# EAGLE design power_breakout_board (EAGLE 7.1.0)
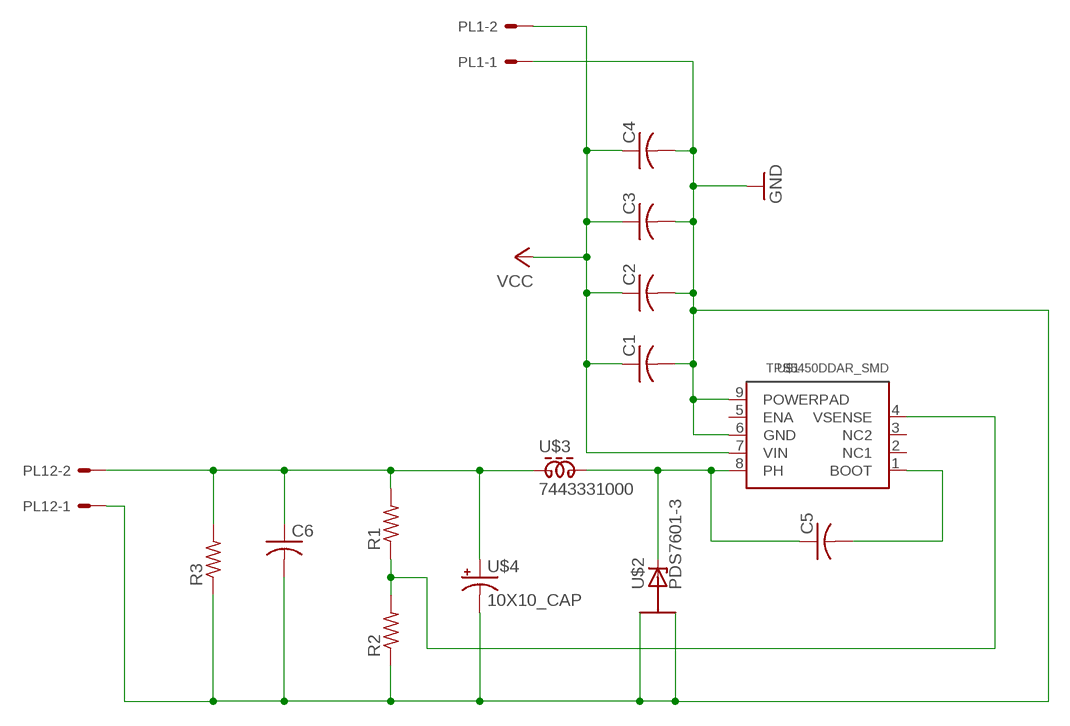
[diagram p0: schematic, sheet 1]

## Parts
C1  C-USC1206K  [C1206K]
C2  C-USC1206K  [C1206K]
C3  C-USC1206K  [C1206K]
C4  C-USC1206K  [C1206K]
C5  C-USC0805K  [C0805K]
C6  C-USC1206K  [C1206K]
PL1  555X-2H  [5569-2]
PL12  555X-2H  [5569-2]
R1  R-US_R1206  [R1206]
R2  R-US_R1206  [R1206]
R3  R-US_R1206  [R1206]
U$1  TPS5450DDAR_SMD  [SO-POWERPAD]
U$2  PDS7601-3  [POWERDI-5_SMD]
U$3  7443331000  [7443331000_SMD]
U$4  10X10_CAP  [10X10_CAP_SMD]

## Nets
GND: C1.2 C2.2 C3.2 C4.2 C6.2 PL1.1 PL12.1 R2.1 R3.1 U$1.6(GND) U$1.9(POWERPAD) U$2.LEFT U$2.RIGHT U$4.-
N$5: C5.2 U$1.1(BOOT)
N$9: R1.1 R2.2 U$1.4(VSENSE)
PH: C5.1 U$1.8(PH) U$2.HEAT U$3.P2
VCC: C1.1 C2.1 C3.1 C4.1 PL1.2 U$1.7(VIN)
VOUT: C6.1 PL12.2 R1.2 R3.2 U$3.P1 U$4.+
Unconnected: U$1.2(NC1) U$1.3(NC2) U$1.5(ENA)

## Library data of the parts
C1-C6 = rcl:C-US: CAPACITOR, American symbol
PL1 PL12 = con-molex-2:555X-2: Mini FIT connector 2 way
R1-R3 = rcl:R-US_: RESISTOR, American symbol
U$1 = TIparts:TPS5450DDAR_SMD
U$2 = TIparts:PDS7601-3
U$3 = TIparts:7443331000
U$4 = TIparts:10X10_CAP

## Board
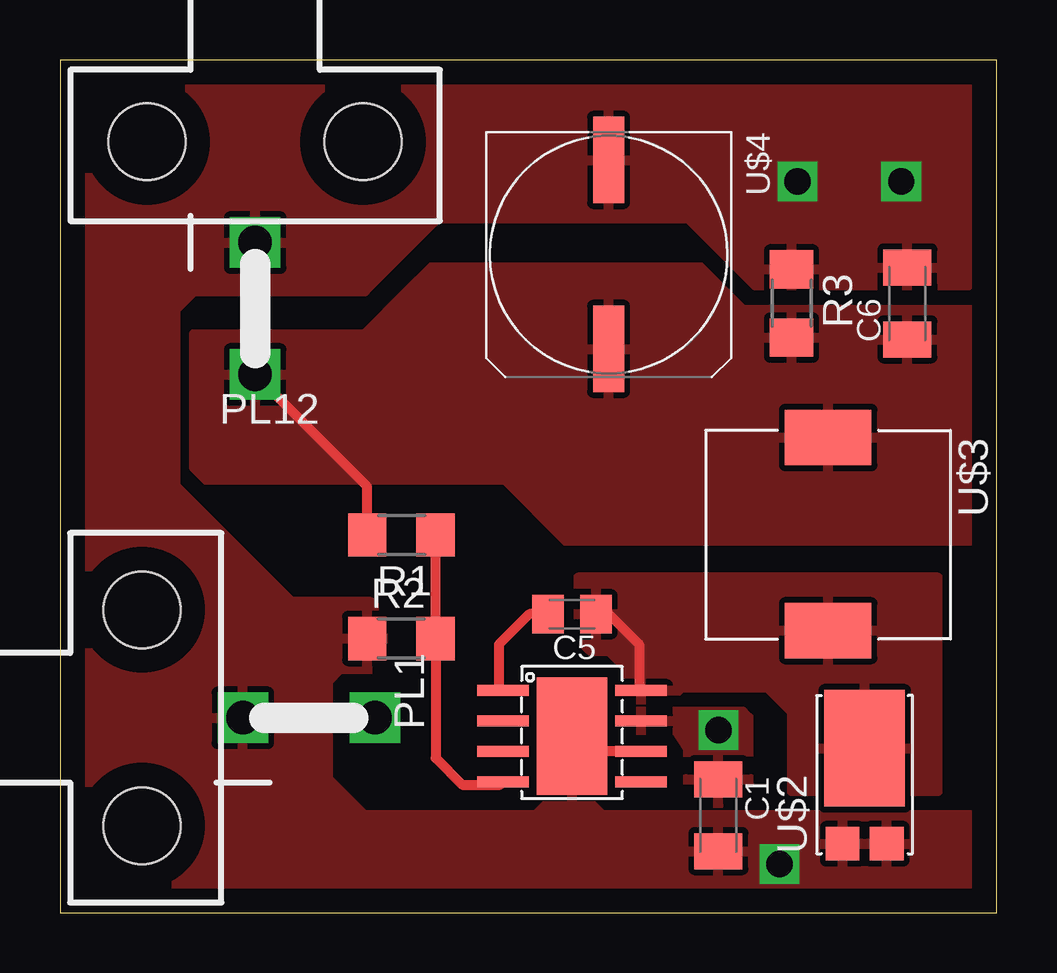
[diagram p1: board, top side]
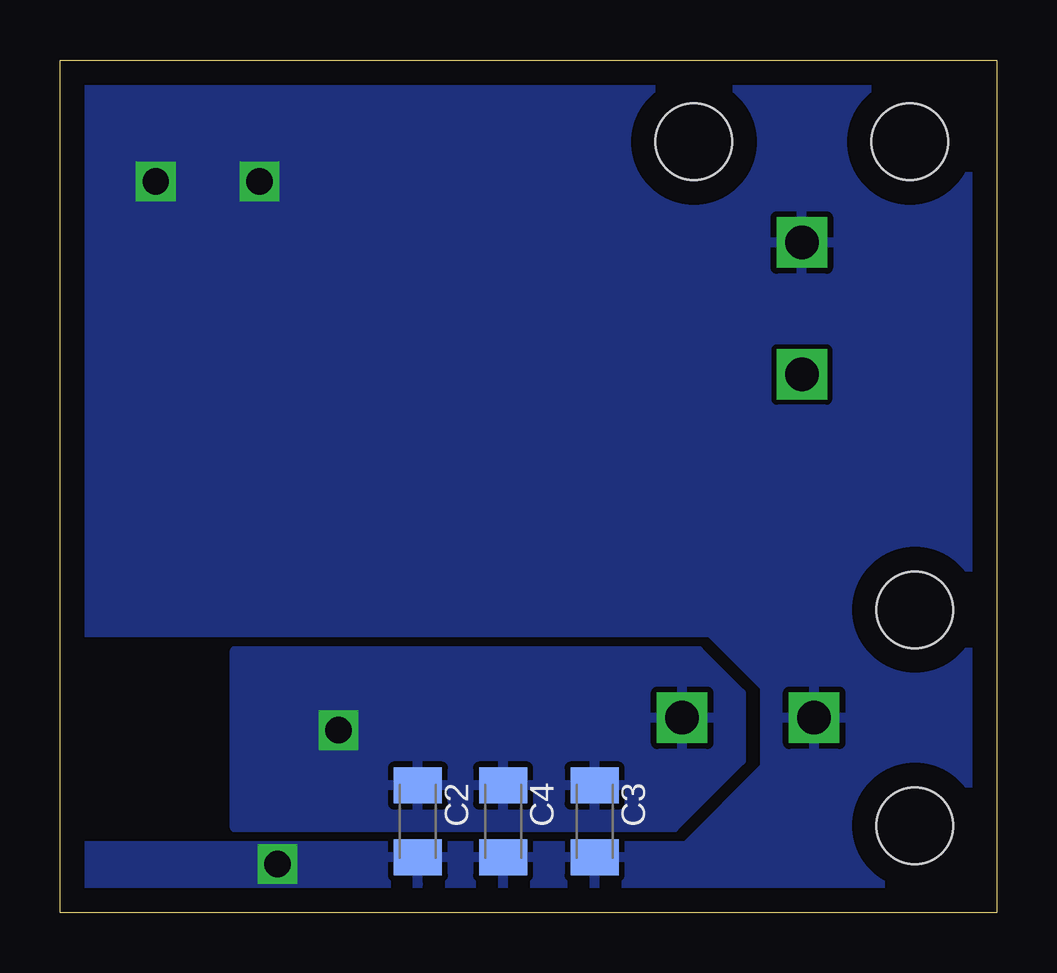
[diagram p2: board, bottom side, seen from below]

Size 39.04 x 35.55 mm. Coordinates in mm from the lower left corner, seen from the top.
Outline: 0,0 39.04,0 39.04,35.55 0,35.55 0,0
Copper layers (1*16): Top 0.035mm / dielectric 1.5mm / Bottom 0.035mm
Design rules "default": minimum track width 10mil, minimum drill 24mil, track to track 8mil, track to pad 8mil, pad to pad 8mil, via to via 8mil, smd to smd 8mil, copper to edge 40mil, drill to drill 8mil, minimum pad ring 10mil, minimum via ring 8mil, stop-mask expansion 4mil, vias tented up to drill 0mil, thermal gap 10mil

### Footprints (pad centres in the part's own frame; a part is rotated, then mirrored left to right if it is on the bottom)
C1206K = smd 1.5 x 2: 1 -1.5,0; 2 1.5,0
C0805K = smd 1.3 x 1.6: 1 -1,0; 2 1,0
5569-2 = drill 1.4 square: 1 0,0; 2 0,5.5 | hole 3.2: 4.5,-4.2; -4.5,-4.2
R1206 = smd 1.6 x 1.803: 1 -1.422,0; 2 1.422,0
SO-POWERPAD = smd 0.45 x 2.15: 1 -1.905,-2.875; 2 -0.635,-2.875; 3 0.635,-2.875; 4 1.905,-2.875; 5 1.905,2.875; 6 0.635,2.875; 7 -0.635,2.875; 8 -1.905,2.875 | smd 4.89 x 2.94: 9 0,0
POWERDI-5_SMD = smd 3.36 x 4.86: HEAT 0,0 | smd 1.4 x 1.39: LEFT -0.92,-3.982; RIGHT 0.92,-3.982
7443331000_SMD = smd 2.3 x 3.6: P1 0,0; P2 8.05,0
10X10_CAP_SMD = smd 3.6 x 1.3: + 3.925,0; - -3.95,0

### Placement (x,y rotation side)
C1  27.43,4.06 270 top
C2  24.13,3.81 270 bottom
C3  16.76,3.81 270 bottom
C4  20.57,3.81 270 bottom
C5  21.34,12.45 180 top
C6  35.31,25.4 90 top
PL1  7.62,8.13 270 top
PL12  8.13,27.94 180 top
R1  14.22,15.75 180 top
R2  14.22,11.43 0 top
R3  30.48,25.4 270 top
U$1  21.34,7.37 270 top
U$2  33.53,6.86 0 top
U$3  32,19.81 270 top
U$4  22.86,27.43 270 top

### Tracks (layer width: path | path; a pad name or v marks a point on that pad's centre or on a via)
GND  (via drill 1.1)
  Top 0.406: U$1.6 21.97,6.73 U$1.9
  other vias: 29.97,2.03 30.73,30.48 35.05,30.48
  pour Bottom: 9.65,8.13 9.65,9.4 11.94,11.68 38.61,11.68 38.86,11.94 38.86,35.31 0,35.31 0,0 39.12,0 39.12,2.79 12.95,2.79 9.65,6.1
  pour Top (isolate 0.254): 38.61,4.06 22.61,4.06 22.1,4.57 22.1,9.14 20.57,9.14 20.57,4.83 19.81,4.06 12.7,4.06 11.18,5.59 11.18,9.65 11.68,10.16 12.95,10.16 13.46,10.67 13.46,12.45 12.95,12.95 9.65,12.95 4.83,17.78 4.83,25.15 5.59,25.91 12.7,25.91 15.75,28.96 26.16,28.96 28.96,26.16 37.85,26.16 37.85,34.29 38.1,34.54 0.25,34.54 0,34.8 0,0 38.86,0 38.86,4.06
N$5
  Top 0.406: C5.2 19.56,12.45 18.29,11.18 18.29,9.44 U$1.1
N$9
  Top 0.406: U$1.4 18.33,5.33 16.76,5.33 15.65,6.45 R2.2 R1.1
PH
  Top 0.406: C5.1 22.86,12.45 24.13,11.18 24.13,9.35 U$1.8
  pour Top: 23.62,8.89 25.4,8.89 25.91,9.4 29.46,9.4 30.48,8.38 30.48,5.08 36.58,5.08 36.58,13.97 21.59,13.97 21.59,11.43 22.1,10.92 22.86,10.92 23.62,10.16
VCC  (via drill 1.1)
  other vias: 27.43,7.62
  pour Bottom: 10.67,8.13 10.67,6.35 13.46,3.56 31.75,3.56 31.75,10.92 12.45,10.92 10.67,9.14
  pour Top: 23.37,7.62 25.65,7.62 26.16,6.86 26.16,4.57 28.7,4.57 28.7,8.13 28.45,8.38 23.37,8.38
VOUT
  Top 0.406: R1.2 12.8,17.77 PL12.2
  pour Top (isolate 0.254): 38.61,15.49 21.08,15.49 18.54,18.03 6.1,18.03 5.59,18.54 5.59,24.13 12.7,24.13 14.48,25.91 15.49,26.92 26.67,26.92 28.45,25.15 38.1,25.15 38.61,25.15